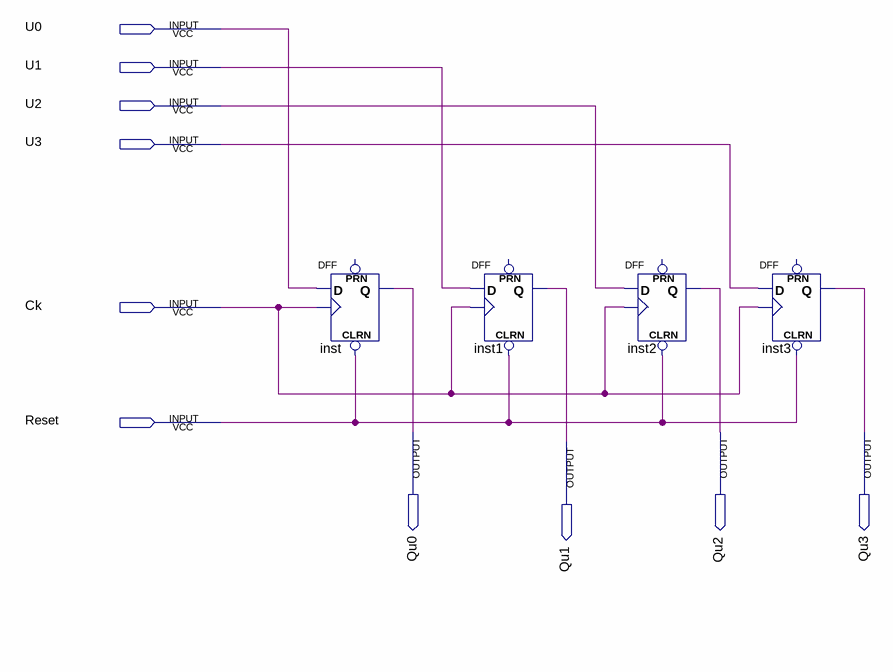
[diagram p0: schematic sheet]
// Quartus schematic Reg4bits.bdf as structural Verilog: 4 symbols, 10 pins
module Reg4bits (
  input  U0,
  input  U1,
  input  U2,
  input  U3,
  input  Ck,
  input  Reset,
  output Qu0,
  output Qu2,
  output Qu3,
  output Qu1
);

  DFF inst (.CLRN(Reset), .CLK(Ck), .D(U0), .Q(Qu0));  // open: PRN
  DFF inst1 (.CLRN(Reset), .CLK(Ck), .D(U1), .Q(Qu1));  // open: PRN
  DFF inst2 (.CLRN(Reset), .CLK(Ck), .D(U2), .Q(Qu2));  // open: PRN
  DFF inst3 (.CLRN(Reset), .CLK(Ck), .D(U3), .Q(Qu3));  // open: PRN
endmodule
